# Altium project Balancer Robot.PrjPcb
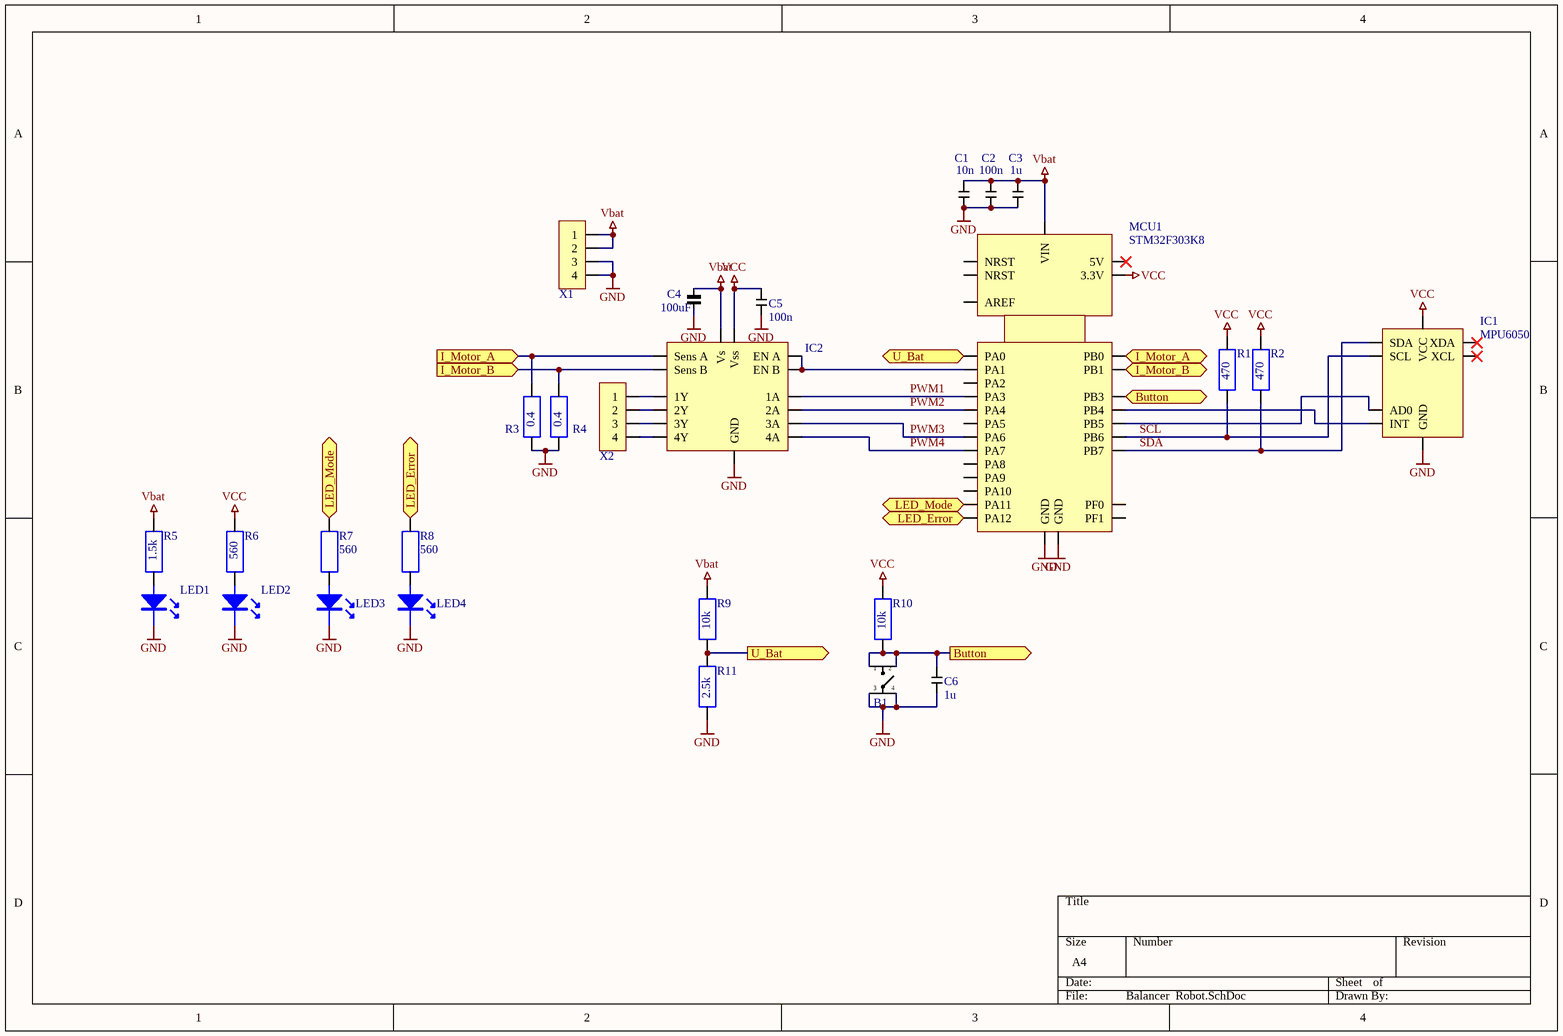
[diagram p0: Balancer  Robot.SchDoc]
1 sheet, 27 parts. Net scope: flat (ports and power ports of the same name join across sheets).
Board file: Balancer  Robot.PcbDoc

## Sheet Balancer  Robot.SchDoc
size A4

### Parts
B1  SMD Button  [Button SMD]  (value not drawn)
C1  10n  [0805_R]
C2  100n  [0805_R]
C3  1u  [0805_R]
C4  100uF  [CAPAE9083X105N]
C5  100n  [0805_R]
C6  1u  [0805_R]
IC1  MPU6050  [MPU6050-Board]
IC2  L298N  [Multiwatt15]  (value not drawn)
LED1  APT3216CGCK  [LED_3216_GREEN]  (value not drawn)
LED2  APT3216CGCK  [LED_3216_GREEN]  (value not drawn)
LED3  APT3216CGCK  [LED_3216_GREEN]  (value not drawn)
LED4  APT3216CGCK  [LED_3216_GREEN]  (value not drawn)
MCU1  STM32F303K8  [Nucleo STM32F303K8]
R1  Comment_1: 470  [0805_R]  (hidden comment: Chip Resistor 10k, 0805, 1%)
R2  Comment_1: 470  [0805_R]  (hidden comment: Chip Resistor 10k, 0805, 1%)
R3  Comment_1: 0.4  [2512_R]  (hidden comment: Chip Resistor 10k, 0805, 1%)
R4  Comment_1: 0.4  [2512_R]  (hidden comment: Chip Resistor 10k, 0805, 1%)
R5  Comment_1: 1.5k  [0805_R]  (hidden comment: Chip Resistor 10k, 0805, 1%)
R6  Comment_1: 560  [0805_R]  (hidden comment: Chip Resistor 10k, 0805, 1%)
R7  Comment_1: 560  [0805_R]  (hidden comment: Chip Resistor 10k, 0805, 1%)
R8  Comment_1: 560  [0805_R]  (hidden comment: Chip Resistor 10k, 0805, 1%)
R9  Comment_1: 10k  [0805_R]  (hidden comment: Chip Resistor 10k, 0805, 1%)
R10  Comment_1: 10k  [0805_R]  (hidden comment: Chip Resistor 10k, 0805, 1%)
R11  Comment_1: 2.5k  [0805_R]  (hidden comment: Chip Resistor 10k, 0805, 1%)
X1  Pin Header 4x1 2.54mm  [PTSM 0,5 4-2,5-H SMD]  (value not drawn)
X2  Pin Header 4x1 2.54mm  [PTSM 0,5 4-2,5-H SMD]  (value not drawn)

### Ports
Button (in), Button (out), I_Motor_A (in), I_Motor_B (in), LED_Error (in), LED_Error (out), LED_Mode (in), LED_Mode (out), U_Bat (in), U_Bat (out)

### Nets
GND: B1.2 C1.1 C2.1 C3.1 C4.2 C5.1 C6.1 IC1.2(GND) IC2.8(GND) LED1.K LED2.K LED3.K LED4.K MCU1.4(GND) MCU1.17(GND) R3.1 R4.1 R11.1 X1.3 X1.4
Vbat: C1.2 C2.2 C3.2 C4.1 IC2.4(Vs) MCU1.16(VIN) R5.2 R9.2 X1.1 X1.2
VCC: C5.2 IC1.1(VCC) IC2.9(Vss) MCU1.29(3.3V) R1.2 R2.2 R6.2 R10.2
PWM1: IC2.5(1A) MCU1.25(PA3)
PWM2: IC2.7(2A) MCU1.24(PA4)
PWM3: IC2.10(3A) MCU1.22(PA6)
PWM4: IC2.12(4A) MCU1.21(PA7)
SCL: IC1.3(SCL) MCU1.8(PB6) R1.1
SDA: IC1.4(SDA) MCU1.7(PB7) R2.1
NetB1_1: B1.1 C6.2 MCU1.30(PB3) R10.1 ; port Button
NetIC1_7: IC1.7(AD0) MCU1.14(PB5)
NetIC1_8: IC1.8(INT) MCU1.15(PB4)
NetIC2_1: IC2.1(Sens_A) MCU1.6(PB0) R3.2 ; port I_Motor_A
NetIC2_2: IC2.2(1Y) X2.1
NetIC2_3: IC2.3(2Y) X2.2
NetIC2_6: IC2.6(EN_A) IC2.11(EN_B) MCU1.26(PA1)
NetIC2_13: IC2.13(3Y) X2.3
NetIC2_14: IC2.14(4Y) X2.4
NetIC2_15: IC2.15(Sens_B) MCU1.9(PB1) R4.2 ; port I_Motor_B
NetLED1_A: LED1.A R5.1
NetLED2_A: LED2.A R6.1
NetLED3_A: LED3.A R7.1
NetLED4_A: LED4.A R8.1
NetMCU1_5: MCU1.5(PA12) R8.2 ; port LED_Error
NetMCU1_13: MCU1.13(PA11) R7.2 ; port LED_Mode
NetMCU1_27: MCU1.27(PA0) R9.1 R11.2 ; port U_Bat

Not connected (* = marked no-connect by the designer): IC1 5(XDA)* 6(XCL)*; MCU1 1(PA9) 2(PA10) 3(NRST) 10(PF0) 11(PF1) 12(PA8) 18(NRST) 19(5V)* 20(PA2) 23(PA5) 28(AREF)

### Notes on the sheet
- (in symbol Button SMD) 3; 4

### Library data of the parts
B1 = Button SMD: SMD Button J-Lead; Manufacturer: Würth Elektronik; Part Number: 430451025836; Supplier 1: Mouser; Supplier Part Number 1: -; Price: -
C1-C3 C5 C6 = Capacitor 0805: Ceramic Capacitor 0805
C4 = Cap 330uF: Part Number: 25SVPF100M; Manufacturer: Panasonic; Supplier 1: Mouser; Supplier Part Number 1: 667-25SVPF100M; Price: 1.50
IC1 = MPU6050 Board: MPU6050 Sensor Board; Part Number: GY-521; Supplier 1: Digitec; Manufacturer: -; Price: 8.80; Supplier Part Number 1: 8193998
IC2 = L298N: Motor Driver, 4A Output; Manufacturer: STMicroelectronics; Part Number: L298N; Supplier 1: Mouser; Package: Multiwatt-15; Price: 4.75; Supplier Part Number 1: 511-L298
LED1-LED4 = LED: LED SMD green APT3216CGCK; Manufacturer: Kingbright; Part Number: 604-APT3216CGCK; Comment_1: APT-3216CGCK; Footprint: 1206; Notes: -; Price: 0.4; Supplier 1: Mouser; Supplier Part Number 1: APT3216CGCK
MCU1 = Nucleo STM32F303K8: Manufacturer: STMicroelectronics; Part Number: NUCLEO-F303K8; Supplier 1: Mouser; Supplier Part Number 1: 511-NUCLEO-F303K8; Price: 10.49; Package: -
R1-R11 = RESISTOR: Resistor 10k 0.125W 0805; Manufacturer: Vishay; Part Number: CRCW080510K0FKEAC; Footprint: 0805; Supplier Part Number 1: 71-CRCW080510K0FKEAC; Price: 0.19; Supplier 1: Mouser
X1 X2 = PTSM 0,5/ 4-2,5-H SMD: PTSM 4 Pol; Manufacturer: Phoenix Contacdt; Part Number: 1814650; Supplier 1: Mouser; Supplier Part Number 1: 651-1814650; Price: 1.31